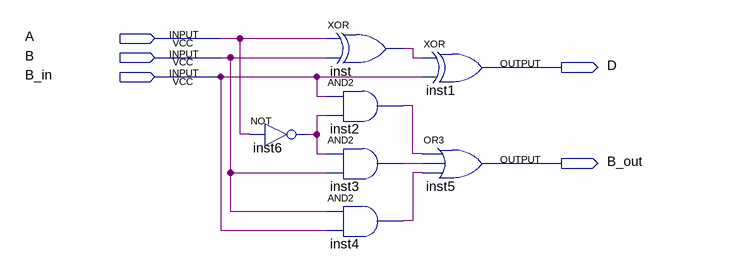
[diagram p0: schematic sheet]
// Quartus schematic SUBTRATOR.bdf as structural Verilog: 7 symbols, 5 pins
module SUBTRATOR (
  input  A,
  input  B,
  input  B_in,
  output D,
  output B_out
);

  wire inst2_out, inst3_out, inst4_out, inst6_out, inst_out;

  not inst6 (inst6_out, A);
  xor inst (inst_out, A, B);
  and inst2 (inst2_out, B_in, inst6_out);
  and inst3 (inst3_out, inst6_out, B);
  and inst4 (inst4_out, B, B_in);
  xor inst1 (D, inst_out, B_in);
  or inst5 (B_out, inst2_out, inst3_out, inst4_out);
endmodule
